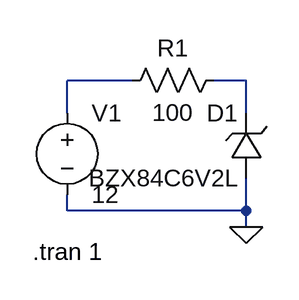
[diagram p0: schematic ConstantVoltage.asc]
ConstantVoltage.asc, the LTspice schematic file:
Version 4
SHEET 1 880 680
WIRE 96 128 32 128
WIRE 208 128 176 128
WIRE 32 160 32 128
WIRE 208 160 208 128
WIRE 32 256 32 240
WIRE 208 256 208 224
WIRE 208 256 32 256
WIRE 208 272 208 256
FLAG 208 272 0
SYMBOL zener 224 224 R180
WINDOW 0 24 64 Left 2
WINDOW 3 24 0 Left 2
SYMATTR InstName D1
SYMATTR Value BZX84C6V2L
SYMBOL res 192 112 R90
WINDOW 0 0 56 VBottom 2
WINDOW 3 32 56 VTop 2
SYMATTR InstName R1
SYMATTR Value 100
SYMBOL voltage 32 144 R0
WINDOW 123 0 0 Left 0
WINDOW 39 0 0 Left 0
SYMATTR InstName V1
SYMATTR Value 12
TEXT -2 296 Left 2 !.tran 1

The netlist it stands for:
* ConstantVoltage.asc
D1 0 N002 BZX84C6V2L
R1 N002 N001 100
V1 N001 0 12
.model D D
.lib standard.dio
.tran 1
.backanno
.end